# EAGLE design 7SD_1_1 (EAGLE 8.3.2)
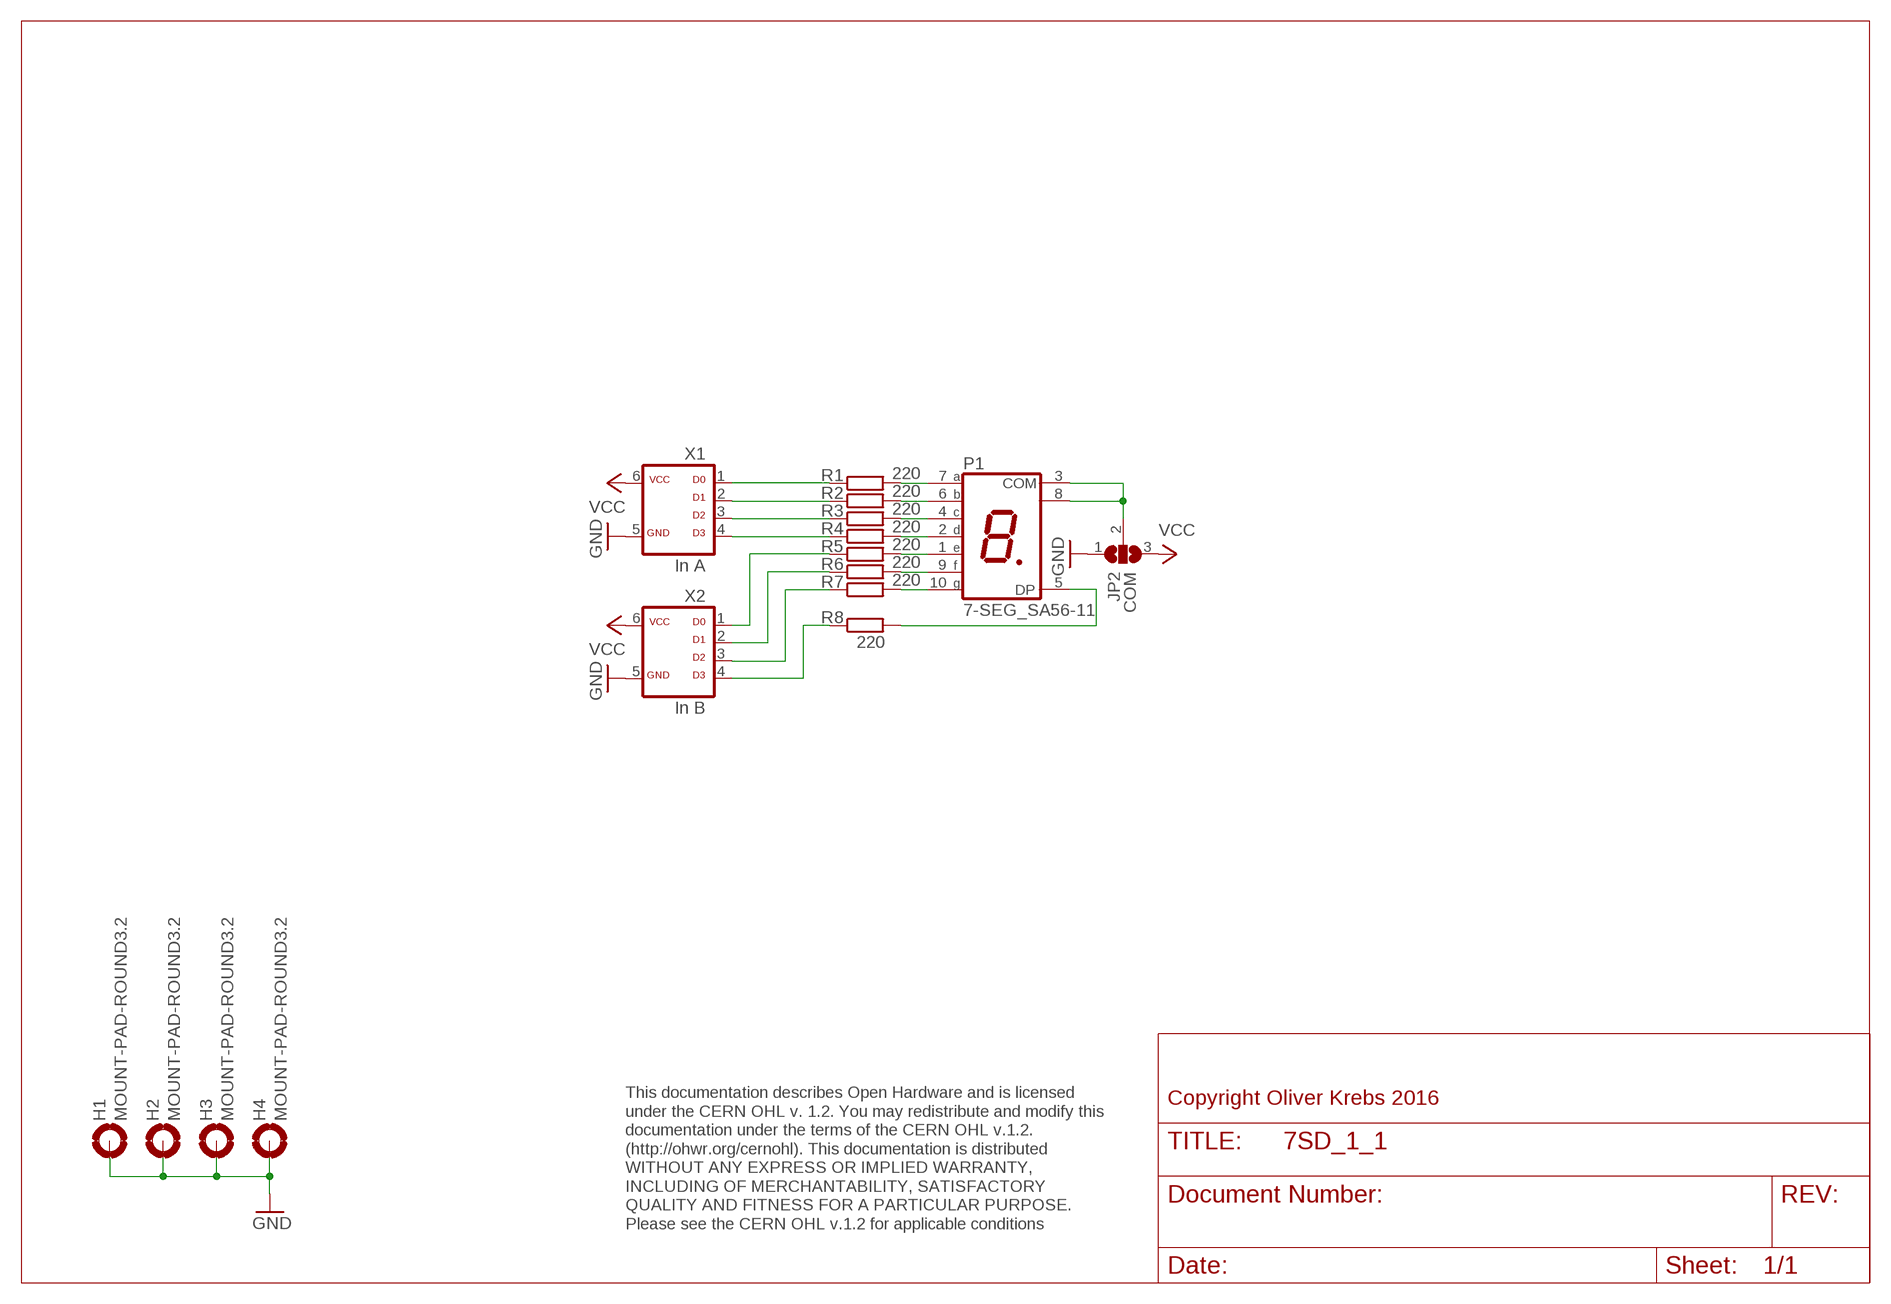
[diagram p0: schematic, sheet 1]

## Parts
H1  MOUNT-PAD-ROUND3.2  [3,2-PAD]
H2  MOUNT-PAD-ROUND3.2  [3,2-PAD]
H3  MOUNT-PAD-ROUND3.2  [3,2-PAD]
H4  MOUNT-PAD-ROUND3.2  [3,2-PAD]
JP2  COM  SJ2W  [SJ_2]
P1  7-SEG_SA56-11  [SA56-11]
R1  220  R-EU_0207/10  [0207/10]
R2  220  R-EU_0207/10  [0207/10]
R3  220  R-EU_0207/10  [0207/10]
R4  220  R-EU_0207/10  [0207/10]
R5  220  R-EU_0207/10  [0207/10]
R6  220  R-EU_0207/10  [0207/10]
R7  220  R-EU_0207/10  [0207/10]
R8  220  R-EU_0207/10  [0207/10]
X1  In A  ML6D  [ML-6]
X2  In B  ML6D  [ML-6]

## Nets
GND: H1.B3,2(MOUNT) H2.B3,2(MOUNT) H3.B3,2(MOUNT) H4.B3,2(MOUNT) JP2.1 X1.5 X2.5
N$1: R1.1 X1.1
N$2: R2.1 X1.2
N$3: R3.1 X1.3
N$4: R4.1 X1.4
N$5: P1.7(A) R1.2
N$6: P1.6(B) R2.2
N$7: P1.4(C) R3.2
N$8: P1.2(D) R4.2
N$9: P1.1(E) R5.2
N$10: P1.9(F) R6.2
N$11: P1.10(G) R7.2
N$12: P1.5(DP) R8.2
N$13: R5.1 X2.1
N$14: R6.1 X2.2
N$15: R7.1 X2.3
N$16: R8.1 X2.4
N$17: JP2.2 P1.3(COM) P1.8(COM)
VCC: JP2.3 X1.6 X2.6

## Notes on the sheet
- Copyright Oliver Krebs 2016
- This documentation describes Open Hardware and is licensed 
  under the CERN OHL v. 1.2. You may redistribute and modify this 
  documentation under the terms of the CERN OHL v.1.2. 
  (http://ohwr.org/cernohl). This documentation is distributed
  WITHOUT ANY EXPRESS OR IMPLIED WARRANTY, 
  INCLUDING OF MERCHANTABILITY, SATISFACTORY 
  QUALITY AND FITNESS FOR A PARTICULAR PURPOSE. 
  Please see the CERN OHL v.1.2 for applicable conditions

## Library data of the parts
H1-H4 = holes:MOUNT-PAD-ROUND: MOUNTING PAD, round
JP2 = jumper:SJ2W: SMD solder JUMPER
P1 = display-kingbright:7-SEG_: Kingbright 14.2mm (0.56 INCH) SINGLE DIGIT NUMERIC DUISPLAY Source: SA56-11EWA(Ver1189471036.pdf; OC_FARNELL: unknown; OC_NEWARK: unknown
R1-R8 = 01-my_rcl:R-EU_: RESISTOR, European symbol
X1 X2 = 01-my-con:ML6D

## Board
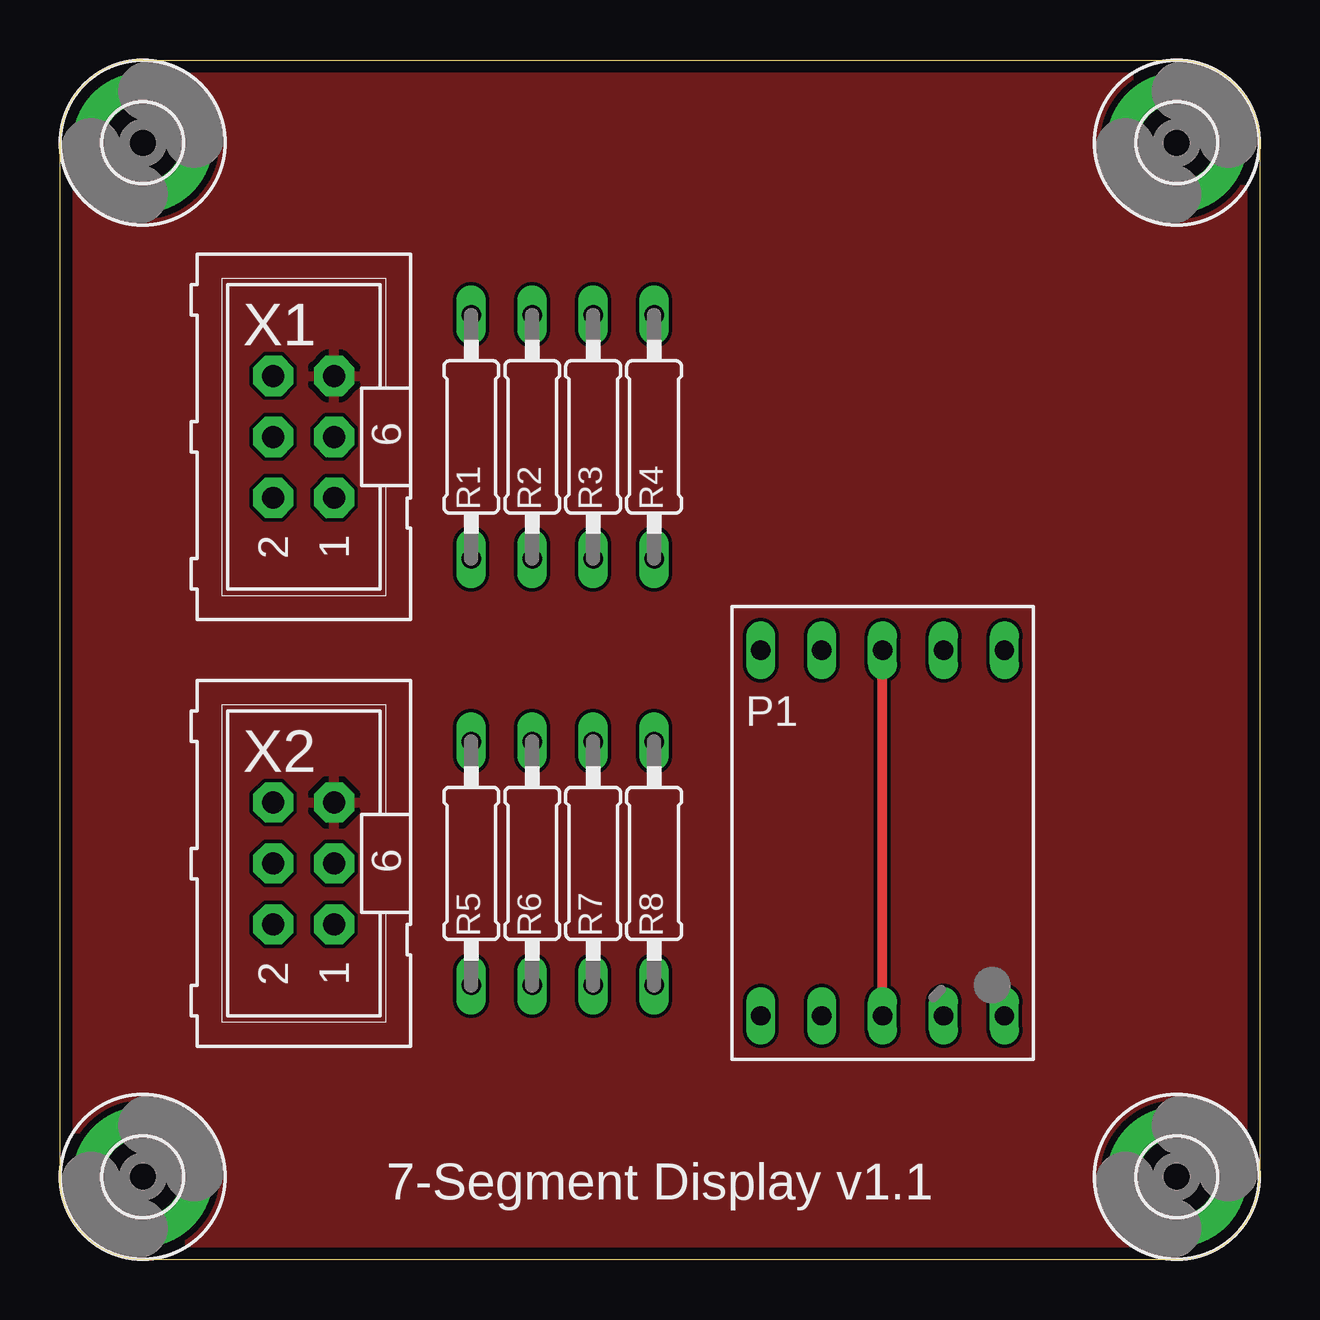
[diagram p1: board, top side]
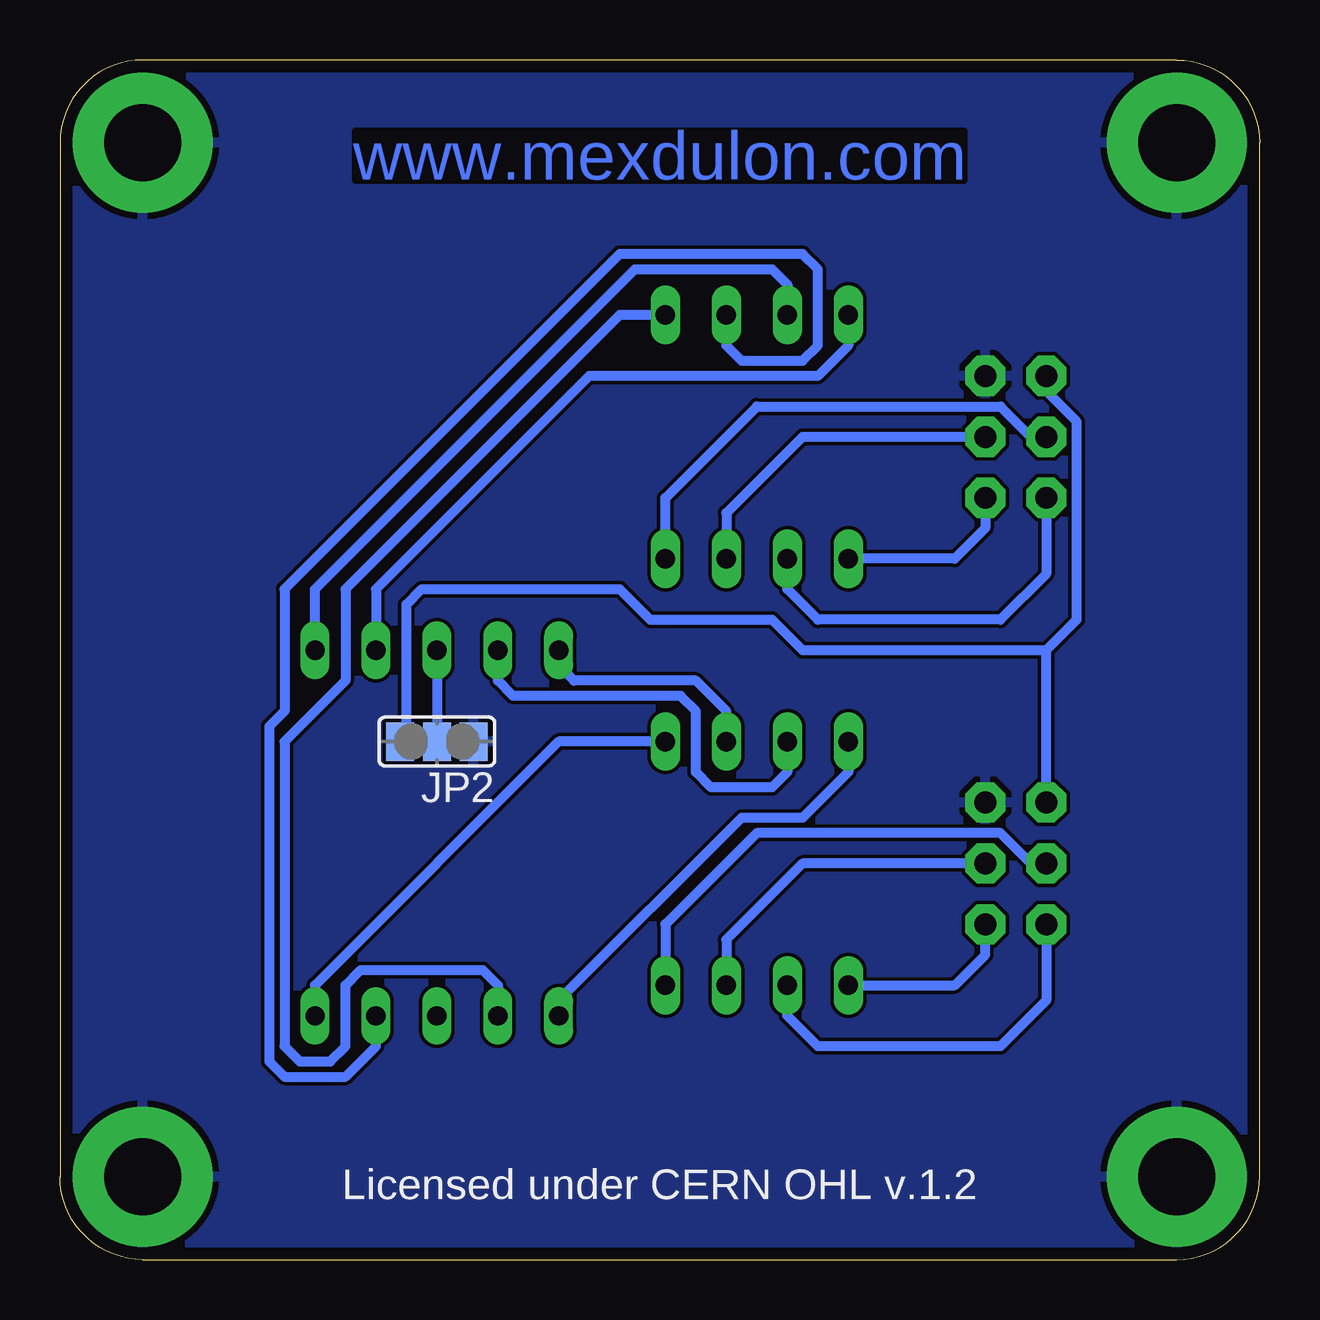
[diagram p2: board, bottom side, seen from below]

Size 50 x 50 mm. Coordinates in mm from the lower left corner, seen from the top.
Outline: 0,3.45 0,46.55 arc-90 3.45,50 46.55,50 arc-90 50,46.55 50,3.45 arc-90 46.55,0 3.45,0 arc-90 0,3.45
Copper layers (1*16): Top 0.035mm / dielectric 1.6mm / Bottom 0.035mm
Design rules "Elecrow_2-layer_PCB_eagle_rule": minimum track width 6mil, minimum drill 12mil, track to track 6mil, track to pad 6mil, pad to pad 6mil, via to via 8mil, smd to smd 0mil, copper to edge 20mil, drill to drill 10mil, minimum pad ring 6mil, minimum via ring 6mil, stop-mask expansion 0mil, vias tented up to drill 100mil, thermal gap 10mil

### Footprints (pad centres in the part's own frame; a part is rotated, then mirrored left to right if it is on the bottom)
3,2-PAD = drill 3.2 pad 5.842: B3,2 0,0
SJ_2 = smd 1.168 x 1.6: 1 -1.524,0; 2 0,0; 3 1.524,0
SA56-11 = drill 0.8 long: 1 -5.08,-7.62; 2 -2.54,-7.62; 3 0,-7.62; 4 2.54,-7.62; 5 5.08,-7.62; 6 5.08,7.62; 7 2.54,7.62; 8 0,7.62; 9 -2.54,7.62; 10 -5.08,7.62
0207/10 = drill 0.813 long: 1 -5.08,0; 2 5.08,0
ML-6 = drill 0.914 pad 1.676 octagon: 1 -2.54,-1.27; 2 -2.54,1.27; 3 0,-1.27; 4 0,1.27; 5 2.54,-1.27; 6 2.54,1.27

### Placement (x,y rotation side)
H1  3.45,3.45 0 top
H2  3.45,46.55 0 top
H3  46.55,3.45 0 top
H4  46.55,46.55 0 top
JP2  34.29,21.59 180 bottom
P1  34.29,17.78 0 top
R1  17.14,34.29 90 top
R2  19.68,34.29 90 top
R3  22.23,34.29 90 top
R4  24.77,34.29 90 top
R5  17.14,16.51 90 top
R6  19.68,16.51 90 top
R7  22.23,16.51 90 top
R8  24.77,16.51 90 top
X1  10.16,34.29 90 top
X2  10.16,16.51 90 top

### Tracks (layer width: path | path; a pad name or v marks a point on that pad's centre or on a via)
GND
  pour Bottom: 0,0 50.8,0 50.8,50.8 0,50.8
  pour Top: 0,50.16 50.16,50.16 50.16,0 0,0
N$1
  Bottom 0.406: X1.1 11.43,30.48 12.7,29.21 R1.1
N$2
  Bottom 0.406: X1.2 8.89,28.57 10.79,26.67 18.41,26.67 19.68,27.94 R2.1
N$3
  Bottom 0.406: X1.3 19.05,34.29 22.23,31.11 R3.1
N$4
  Bottom 0.406: R4.1 24.77,31.75 20.95,35.56 10.79,35.56 9.53,34.29 X1.4
N$5
  Bottom 0.406: R1.2 17.14,38.1 18.41,36.83 27.94,36.83 36.83,27.94 P1.7
N$6
  Bottom 0.406: P1.6 39.37,27.94 26.04,41.27 20.32,41.27 19.68,40.64 R2.2
N$7
  Bottom 0.406: R3.2 22.23,38.1 21.59,37.47 19.05,37.47 18.41,38.1 18.41,41.27 19.05,41.91 26.67,41.91 40.64,27.94 40.64,22.86 41.27,22.23 41.27,8.26 40.64,7.62 38.1,7.62 36.83,8.89 P1.4
N$8
  Bottom 0.406: R4.2 26.67,39.37 38.1,27.94 38.1,24.13 40.64,21.59 40.64,8.89 40.01,8.26 38.73,8.26 38.1,8.89 38.1,11.43 37.47,12.06 32.38,12.06 31.75,11.43 P1.2
N$9
  Bottom 0.406: R5.2 17.14,20.32 19.05,18.41 21.59,18.41 29.21,10.79 P1.1
N$10
  Bottom 0.406: R6.2 19.68,20.32 20.32,19.68 22.86,19.68 23.5,20.32 23.5,22.86 24.13,23.5 31.11,23.5 31.75,24.13 P1.9
N$11
  Bottom 0.406: R7.2 22.23,22.86 23.5,24.13 28.57,24.13 29.21,24.77 P1.10
N$12
  Bottom 0.406: R8.2 29.21,21.59 39.37,11.43 P1.5
N$13
  Bottom 0.406: R5.1 12.7,11.43 11.43,12.7 X2.1
N$14
  Bottom 0.406: X2.2 8.89,10.79 10.79,8.89 18.41,8.89 19.68,10.16 R6.1
N$15
  Bottom 0.406: X2.3 19.05,16.51 22.23,13.34 R7.1
N$16
  Bottom 0.406: X2.4 9.53,16.51 10.79,17.78 20.95,17.78 24.77,13.97 R8.1
N$17
  Top 0.406: P1.3 P1.8
  Bottom 0.406: P1.8 JP2.2
VCC
  Bottom 0.406: X2.6 8.89,25.4 | 8.89,25.4 7.62,26.67 7.62,34.92 8.89,36.2 X1.6 | JP2.3 35.81,21.97 35.56,22.23 35.56,27.3 34.92,27.94 26.67,27.94 25.4,26.67 20.32,26.67 19.05,25.4 8.89,25.4

### Text on the board
Bottom: www.mexdulon.com
tNames: 7-Segment Display v1.1
bNames: Licensed under CERN OHL v.1.2